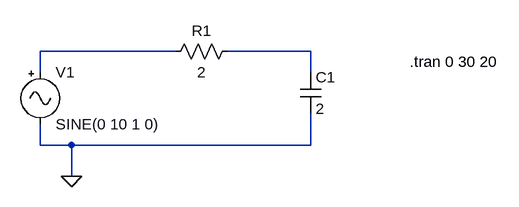
[diagram p0: schematic Analog_capacitor.asc]
Analog_capacitor.asc, the LTspice schematic file:
Version 4.1
SHEET 1 880 680
WIRE 240 64 32 64
WIRE 448 64 320 64
WIRE 32 96 32 64
WIRE 448 96 448 64
WIRE 32 208 32 176
WIRE 80 208 32 208
WIRE 448 208 448 160
WIRE 448 208 80 208
WIRE 80 256 80 208
FLAG 80 256 0
SYMBOL Misc\\signal 32 80 R0
WINDOW 123 0 0 Left 0
WINDOW 39 0 0 Left 0
SYMATTR InstName V1
SYMATTR Value SINE(0 10 1 0)
SYMBOL cap 432 96 R0
SYMATTR InstName C1
SYMATTR Value 2
SYMBOL res 224 80 R270
WINDOW 0 32 56 VTop 2
WINDOW 3 0 56 VBottom 2
SYMATTR InstName R1
SYMATTR Value 2
TEXT 600 80 Left 2 !.tran 0 30 20

The netlist it stands for:
* Analog_capacitor.asc
V1 N001 0 SINE(0 10 1 0)
C1 N002 0 2
R1 N001 N002 2
.tran 0 30 20
.backanno
.end